# Altium schematic sheet 05_INPUT.SchDoc
size 420 x 297 mm; SheetNumber: 5; SheetTotal: 12
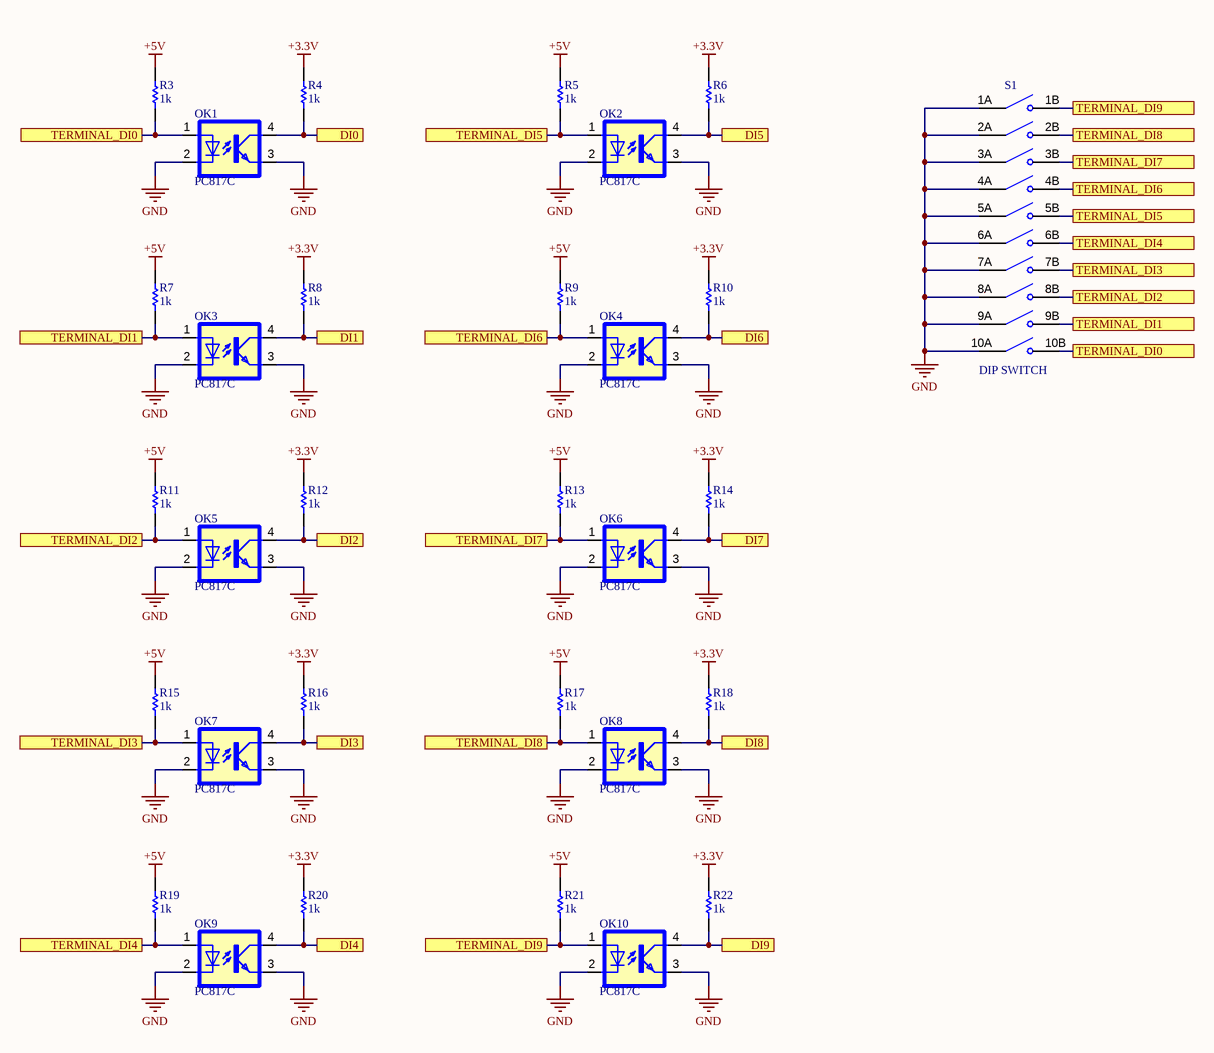
[diagram p0: 05_INPUT.SchDoc]

## Parts
OK1  PC817C  [SOP254P975X460-4N]
OK2  PC817C  [SOP254P975X460-4N]
OK3  PC817C  [SOP254P975X460-4N]
OK4  PC817C  [SOP254P975X460-4N]
OK5  PC817C  [SOP254P975X460-4N]
OK6  PC817C  [SOP254P975X460-4N]
OK7  PC817C  [SOP254P975X460-4N]
OK8  PC817C  [SOP254P975X460-4N]
OK9  PC817C  [SOP254P975X460-4N]
OK10  PC817C  [SOP254P975X460-4N]
R3  ValueDisplayed: 1k  [0603]  (hidden comment: RES 1.5K 0603)
R4  ValueDisplayed: 1k  [0603]  (hidden comment: RES 1.5K 0603)
R5  ValueDisplayed: 1k  [0603]  (hidden comment: RES 1.5K 0603)
R6  ValueDisplayed: 1k  [0603]  (hidden comment: RES 1.5K 0603)
R7  ValueDisplayed: 1k  [0603]  (hidden comment: RES 1.5K 0603)
R8  ValueDisplayed: 1k  [0603]  (hidden comment: RES 1.5K 0603)
R9  ValueDisplayed: 1k  [0603]  (hidden comment: RES 1.5K 0603)
R10  ValueDisplayed: 1k  [0603]  (hidden comment: RES 1.5K 0603)
R11  ValueDisplayed: 1k  [0603]  (hidden comment: RES 1.5K 0603)
R12  ValueDisplayed: 1k  [0603]  (hidden comment: RES 1.5K 0603)
R13  ValueDisplayed: 1k  [0603]  (hidden comment: RES 1.5K 0603)
R14  ValueDisplayed: 1k  [0603]  (hidden comment: RES 1.5K 0603)
R15  ValueDisplayed: 1k  [0603]  (hidden comment: RES 1.5K 0603)
R16  ValueDisplayed: 1k  [0603]  (hidden comment: RES 1.5K 0603)
R17  ValueDisplayed: 1k  [0603]  (hidden comment: RES 1.5K 0603)
R18  ValueDisplayed: 1k  [0603]  (hidden comment: RES 1.5K 0603)
R19  ValueDisplayed: 1k  [0603]  (hidden comment: RES 1.5K 0603)
R20  ValueDisplayed: 1k  [0603]  (hidden comment: RES 1.5K 0603)
R21  ValueDisplayed: 1k  [0603]  (hidden comment: RES 1.5K 0603)
R22  ValueDisplayed: 1k  [0603]  (hidden comment: RES 1.5K 0603)
S1  DIP SWITCH  [SW_DS01-254-L-10BE]

## Ports
DI0 (see 04_STM32F373VBTx[5C]), DI1 (see 04_STM32F373VBTx[5C]), DI2 (see 04_STM32F373VBTx[5C]), DI3 (see 04_STM32F373VBTx[5C]), DI4 (see 04_STM32F373VBTx[5C]), DI5 (see 04_STM32F373VBTx[5C]), DI6 (see 04_STM32F373VBTx[6B]), DI7 (see 04_STM32F373VBTx[6B]), DI8 (see 04_STM32F373VBTx[6C]), DI9 (see 04_STM32F373VBTx[6C]), TERMINAL_DI0 (see 05_INPUT[1A]), TERMINAL_DI0 (see 05_INPUT[4B]), TERMINAL_DI1 (see 05_INPUT[1B]), TERMINAL_DI1 (see 05_INPUT[4B]), TERMINAL_DI2 (see 05_INPUT[1B]), TERMINAL_DI2 (see 05_INPUT[4A]), TERMINAL_DI3 (see 05_INPUT[1C]), TERMINAL_DI3 (see 05_INPUT[4A]), TERMINAL_DI4 (see 05_INPUT[1C]), TERMINAL_DI4 (see 05_INPUT[4A]), TERMINAL_DI5 (see 05_INPUT[2A]), TERMINAL_DI5 (see 05_INPUT[4A]), TERMINAL_DI6 (see 05_INPUT[2B]), TERMINAL_DI6 (see 05_INPUT[4A]), TERMINAL_DI7 (see 05_INPUT[2B]), TERMINAL_DI7 (see 05_INPUT[4A]), TERMINAL_DI8 (see 05_INPUT[2C]), TERMINAL_DI8 (see 05_INPUT[4A]), TERMINAL_DI9 (see 05_INPUT[2C]), TERMINAL_DI9 (see 05_INPUT[4A])

## Nets
+3.3V: R4.2 R6.2 R8.2 R10.2 R12.2 R14.2 R16.2 R18.2 R20.2 R22.2
+5V: R3.2 R5.2 R7.2 R9.2 R11.2 R13.2 R15.2 R17.2 R19.2 R21.2
GND: OK1.2(C) OK1.3(EMIT) OK2.2(C) OK2.3(EMIT) OK3.2(C) OK3.3(EMIT) OK4.2(C) OK4.3(EMIT) OK5.2(C) OK5.3(EMIT) OK6.2(C) OK6.3(EMIT) OK7.2(C) OK7.3(EMIT) OK8.2(C) OK8.3(EMIT) OK9.2(C) OK9.3(EMIT) OK10.2(C) OK10.3(EMIT) S1.1A(COM1) S1.2A(COM2) S1.3A(COM3) S1.4A(COM4) S1.5A(COM5) S1.6A(COM6) S1.7A(COM7) S1.8A(COM8) S1.9A(COM9) S1.10A(COM10)
DI0: OK1.4(COL) R4.1 ; port DI0
DI1: OK3.4(COL) R8.1 ; port DI1
DI2: OK5.4(COL) R12.1 ; port DI2
DI3: OK7.4(COL) R16.1 ; port DI3
DI4: OK9.4(COL) R20.1 ; port DI4
DI5: OK2.4(COL) R6.1 ; port DI5
DI6: OK4.4(COL) R10.1 ; port DI6
DI7: OK6.4(COL) R14.1 ; port DI7
DI8: OK8.4(COL) R18.1 ; port DI8
DI9: OK10.4(COL) R22.1 ; port DI9
TERMINAL_DI0: OK1.1(A) R3.1 S1.10B(NO10) ; port TERMINAL_DI0
TERMINAL_DI1: OK3.1(A) R7.1 S1.9B(NO9) ; port TERMINAL_DI1
TERMINAL_DI2: OK5.1(A) R11.1 S1.8B(NO8) ; port TERMINAL_DI2
TERMINAL_DI3: OK7.1(A) R15.1 S1.7B(NO7) ; port TERMINAL_DI3
TERMINAL_DI4: OK9.1(A) R19.1 S1.6B(NO6) ; port TERMINAL_DI4
TERMINAL_DI5: OK2.1(A) R5.1 S1.5B(NO5) ; port TERMINAL_DI5
TERMINAL_DI6: OK4.1(A) R9.1 S1.4B(NO4) ; port TERMINAL_DI6
TERMINAL_DI7: OK6.1(A) R13.1 S1.3B(NO3) ; port TERMINAL_DI7
TERMINAL_DI8: OK8.1(A) R17.1 S1.2B(NO2) ; port TERMINAL_DI8
TERMINAL_DI9: OK10.1(A) R21.1 S1.1B(NO1) ; port TERMINAL_DI9

## Notes on the sheet
- Sub-system:
- Project:
- Design by:
- Sheet title:
- Sheet
- of
- Checked by:
- Approved by:
- Doc No:
- Revision:
- Size:
- Date:
- A3

## Library data of the parts
OK1-OK10 = PC817C: RF Mixer IC Cellular, DCS, PCS, W-CDMA, WLAN Up Converter 50MHz ~ 400MHz 6-SuperMiniMold; MF: Renesas Electronics America Inc; MP: PC817; SnapEDA_Link: https://www.snapeda.com/parts/PC817/Renesas/view-part/?ref=snap; Package: None; Value: *; Check_prices: https://www.snapeda.com/parts/PC817/Renesas/view-part/?ref=eda
R3-R22 = RES 1.5K 0603 1%: RES, 1.5K, 1%, 0.1 W, AEC-Q200 Grade 0, 0603; Manufacturer: Vishay-Dale; PartNumber: CRCW060320R0JNEA; Power_W: 100mW; TempCo: 200 ppm/C; Value_Code: 20R0; Value1: 5%; Value: 20; EIA_Code: E24; SizeX_mm: 1.6; SizeY_mm: 0.8; SizeZ_mm: 1; Value2: 0.1W; SizeArea_mm2: 1.28; CompType: Resistor; AEC Qualified: Y; VDC_V: 75V; AEC Category: Q200; AEC Grade: 0; Supplier Part Number 2: 59M6784; Supplier 2: Newark; Supplier Part Number 3: 71-CRCW0603J-20-E3; Supplier 3: Mouser; RoHS: E; MountType: SMT; Supplier 1: Digi-Key; PackageReference: 0603; Tolerance_%: 5%; Res_ohm: 20; ComponentLink1Description: Datasheet link; Supplier Part Number 1: 541-20GCT-ND; Technology: Thick Film; ComponentLink1URL: http://www.vishay.com/docs/20035/dcrcwe3.pdf
S1 = DS01-254-L-10BE: 10 Position, Through Hole, 2.54 mm Pitch, Raised Slide Actuator, Flat Bottom, Long Pin, DIP Switch; MF: Same Sky; SnapEDA_Link: https://www.snapeda.com/parts/DS01-254-L-10BE/Same+Sky/view-part/?ref=snap; Package: None; Value: *; MP: DS01-254-L-10BE; Check_prices: https://www.snapeda.com/parts/DS01-254-L-10BE/Same+Sky/view-part/?ref=eda